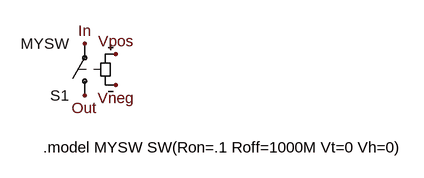
[diagram p0: schematic switch.asc]
switch.asc, the LTspice schematic file:
Version 4
SHEET 1 880 680
FLAG 208 112 In
FLAG 208 192 Out
FLAG 256 128 Vpos
FLAG 256 176 Vneg
SYMBOL sw 208 208 R180
SYMATTR InstName S1
SYMATTR Value MYSW
TEXT 144 272 Left 2 !.model MYSW SW(Ron=.1 Roff=1000M Vt=0 Vh=0)

The netlist it stands for:
* switch.asc
S1 Out In Vpos Vneg MYSW
.model MYSW SW(Ron=.1 Roff=1000M Vt=0 Vh=0)
.backanno
.end